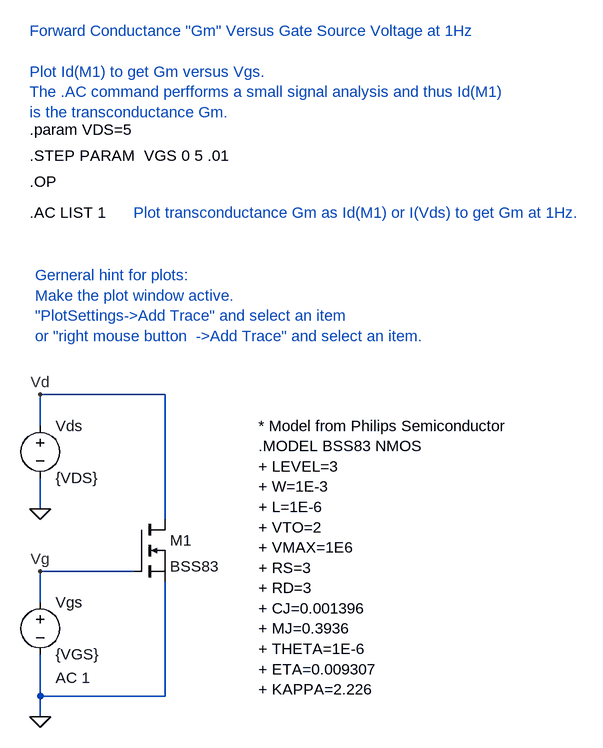
[diagram p0: schematic gm_of_vgs_const_vds_ac.asc]
gm_of_vgs_const_vds_ac.asc, the LTspice schematic file:
Version 4
SHEET 1 1208 724
WIRE -96 320 -96 272
WIRE 96 432 96 608
WIRE 96 608 -96 608
WIRE -96 464 -96 416
WIRE -96 544 -96 608
WIRE -96 640 -96 608
WIRE -96 192 -96 144
WIRE 48 416 -96 416
WIRE -96 144 96 144
WIRE 96 144 96 336
FLAG -96 640 0
FLAG -96 320 0
FLAG -96 144 Vd
FLAG -96 416 Vg
SYMBOL voltage -96 448 R0
WINDOW 123 24 132 Left 0
WINDOW 39 0 0 Left 0
SYMATTR Value2 AC 1
SYMATTR InstName Vgs
SYMATTR Value {VGS}
SYMBOL voltage -96 176 R0
WINDOW 123 24 132 Left 0
WINDOW 39 0 0 Left 0
SYMATTR InstName Vds
SYMATTR Value {VDS}
SYMBOL nmos 48 336 R0
SYMATTR InstName M1
SYMATTR Value BSS83
TEXT -112 -224 Left 0 !.STEP PARAM  VGS 0 5 .01
TEXT -112 -184 Left 0 !.OP
TEXT -112 -136 Left 0 !.AC LIST 1
TEXT 48 -136 Left 0 ;Plot transconductance Gm as Id(M1) or I(Vds) to get Gm at 1Hz.
TEXT -112 -416 Left 0 ;Forward Conductance "Gm" Versus Gate Source Voltage at 1Hz\n \nPlot Id(M1) to get Gm versus Vgs.  \nThe .AC command perfforms a small signal analysis and thus Id(M1)\nis the transconductance Gm.
TEXT -104 -40 Left 0 ;Gerneral hint for plots:\nMake the plot window active. \n"PlotSettings->Add Trace" and select an item\nor "right mouse button  ->Add Trace" and select an item.
TEXT -112 -264 Left 0 !.param VDS=5
TEXT 240 192 Left 0 !* Model from Philips Semiconductor\n.MODEL BSS83 NMOS\n+ LEVEL=3\n+ W=1E-3\n+ L=1E-6\n+ VTO=2\n+ VMAX=1E6\n+ RS=3\n+ RD=3\n+ CJ=0.001396\n+ MJ=0.3936\n+ THETA=1E-6\n+ ETA=0.009307\n+ KAPPA=2.226

The netlist it stands for:
* gm_of_vgs_const_vds_ac.asc
Vgs Vg 0 {VGS} AC 1
Vds Vd 0 {VDS}
M1 Vd Vg 0 0 BSS83
.model NMOS NMOS
.model PMOS PMOS
.lib standard.mos
.STEP PARAM  VGS 0 5 .01
.OP
.AC LIST 1
* Plot transconductance Gm as Id(M1) or I(Vds) to get Gm at 1Hz.
* Forward Conductance "Gm" Versus Gate Source Voltage at 1Hz
* Plot Id(M1) to get Gm versus Vgs.
* The .AC command perfforms a small signal analysis and thus Id(M1)
* is the transconductance Gm.
* Gerneral hint for plots:
* Make the plot window active.
* "PlotSettings->Add Trace" and select an item
* or "right mouse button  ->Add Trace" and select an item.
.param VDS=5
* Model from Philips Semiconductor
.MODEL BSS83 NMOS
+ LEVEL=3
+ W=1E-3
+ L=1E-6
+ VTO=2
+ VMAX=1E6
+ RS=3
+ RD=3
+ CJ=0.001396
+ MJ=0.3936
+ THETA=1E-6
+ ETA=0.009307
+ KAPPA=2.226
.backanno
.end